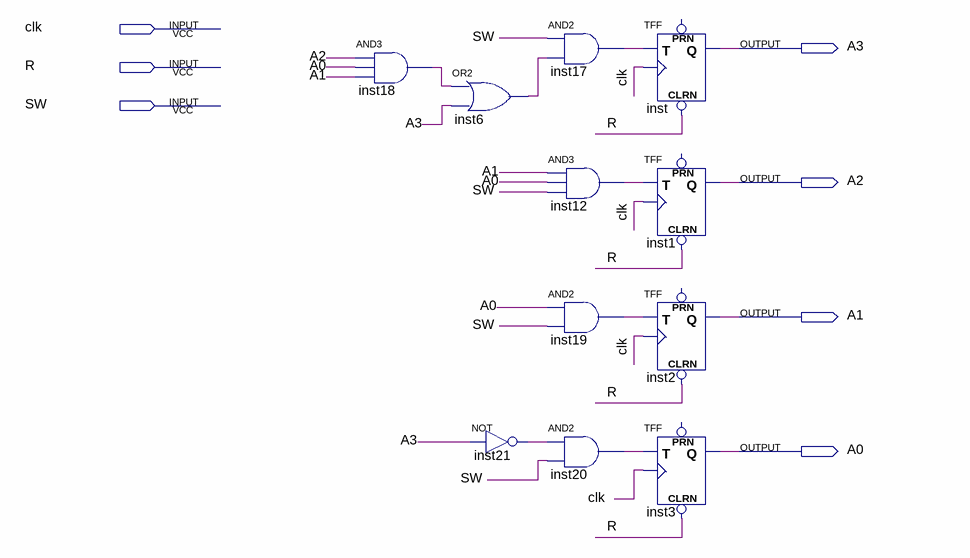
[diagram p0: schematic sheet]
// Quartus schematic counter.bdf as structural Verilog: 11 symbols, 7 pins
module counter (
  input  clk,
  input  R,
  input  SW,
  output A3,
  output A2,
  output A1,
  output A0
);

  wire inst6_out, inst12_out, inst17_out, inst18_out, inst19_out, inst20_out, inst21_out;

  and inst18 (inst18_out, A2, A0, A1);
  or inst6 (inst6_out, inst18_out, A3);
  not inst21 (inst21_out, A3);
  and inst17 (inst17_out, SW, inst6_out);
  and inst12 (inst12_out, A1, A0, SW);
  and inst19 (inst19_out, A0, SW);
  and inst20 (inst20_out, inst21_out, SW);
  TFF inst (.CLRN(R), .T(inst17_out), .CLK(clk), .Q(A3));  // open: PRN
  TFF inst1 (.CLRN(R), .T(inst12_out), .CLK(clk), .Q(A2));  // open: PRN
  TFF inst2 (.CLRN(R), .T(inst19_out), .CLK(clk), .Q(A1));  // open: PRN
  TFF inst3 (.CLRN(R), .T(inst20_out), .CLK(clk), .Q(A0));  // open: PRN
endmodule
